# Altium schematic sheet BLOCK DIAGRAM.SchDoc
size A2; Organization: Altium Limited; Address1: L3, 12a Rodborough Rd; Address2: Frenchs Forest; Address3: NSW; Address4: Australia 2086
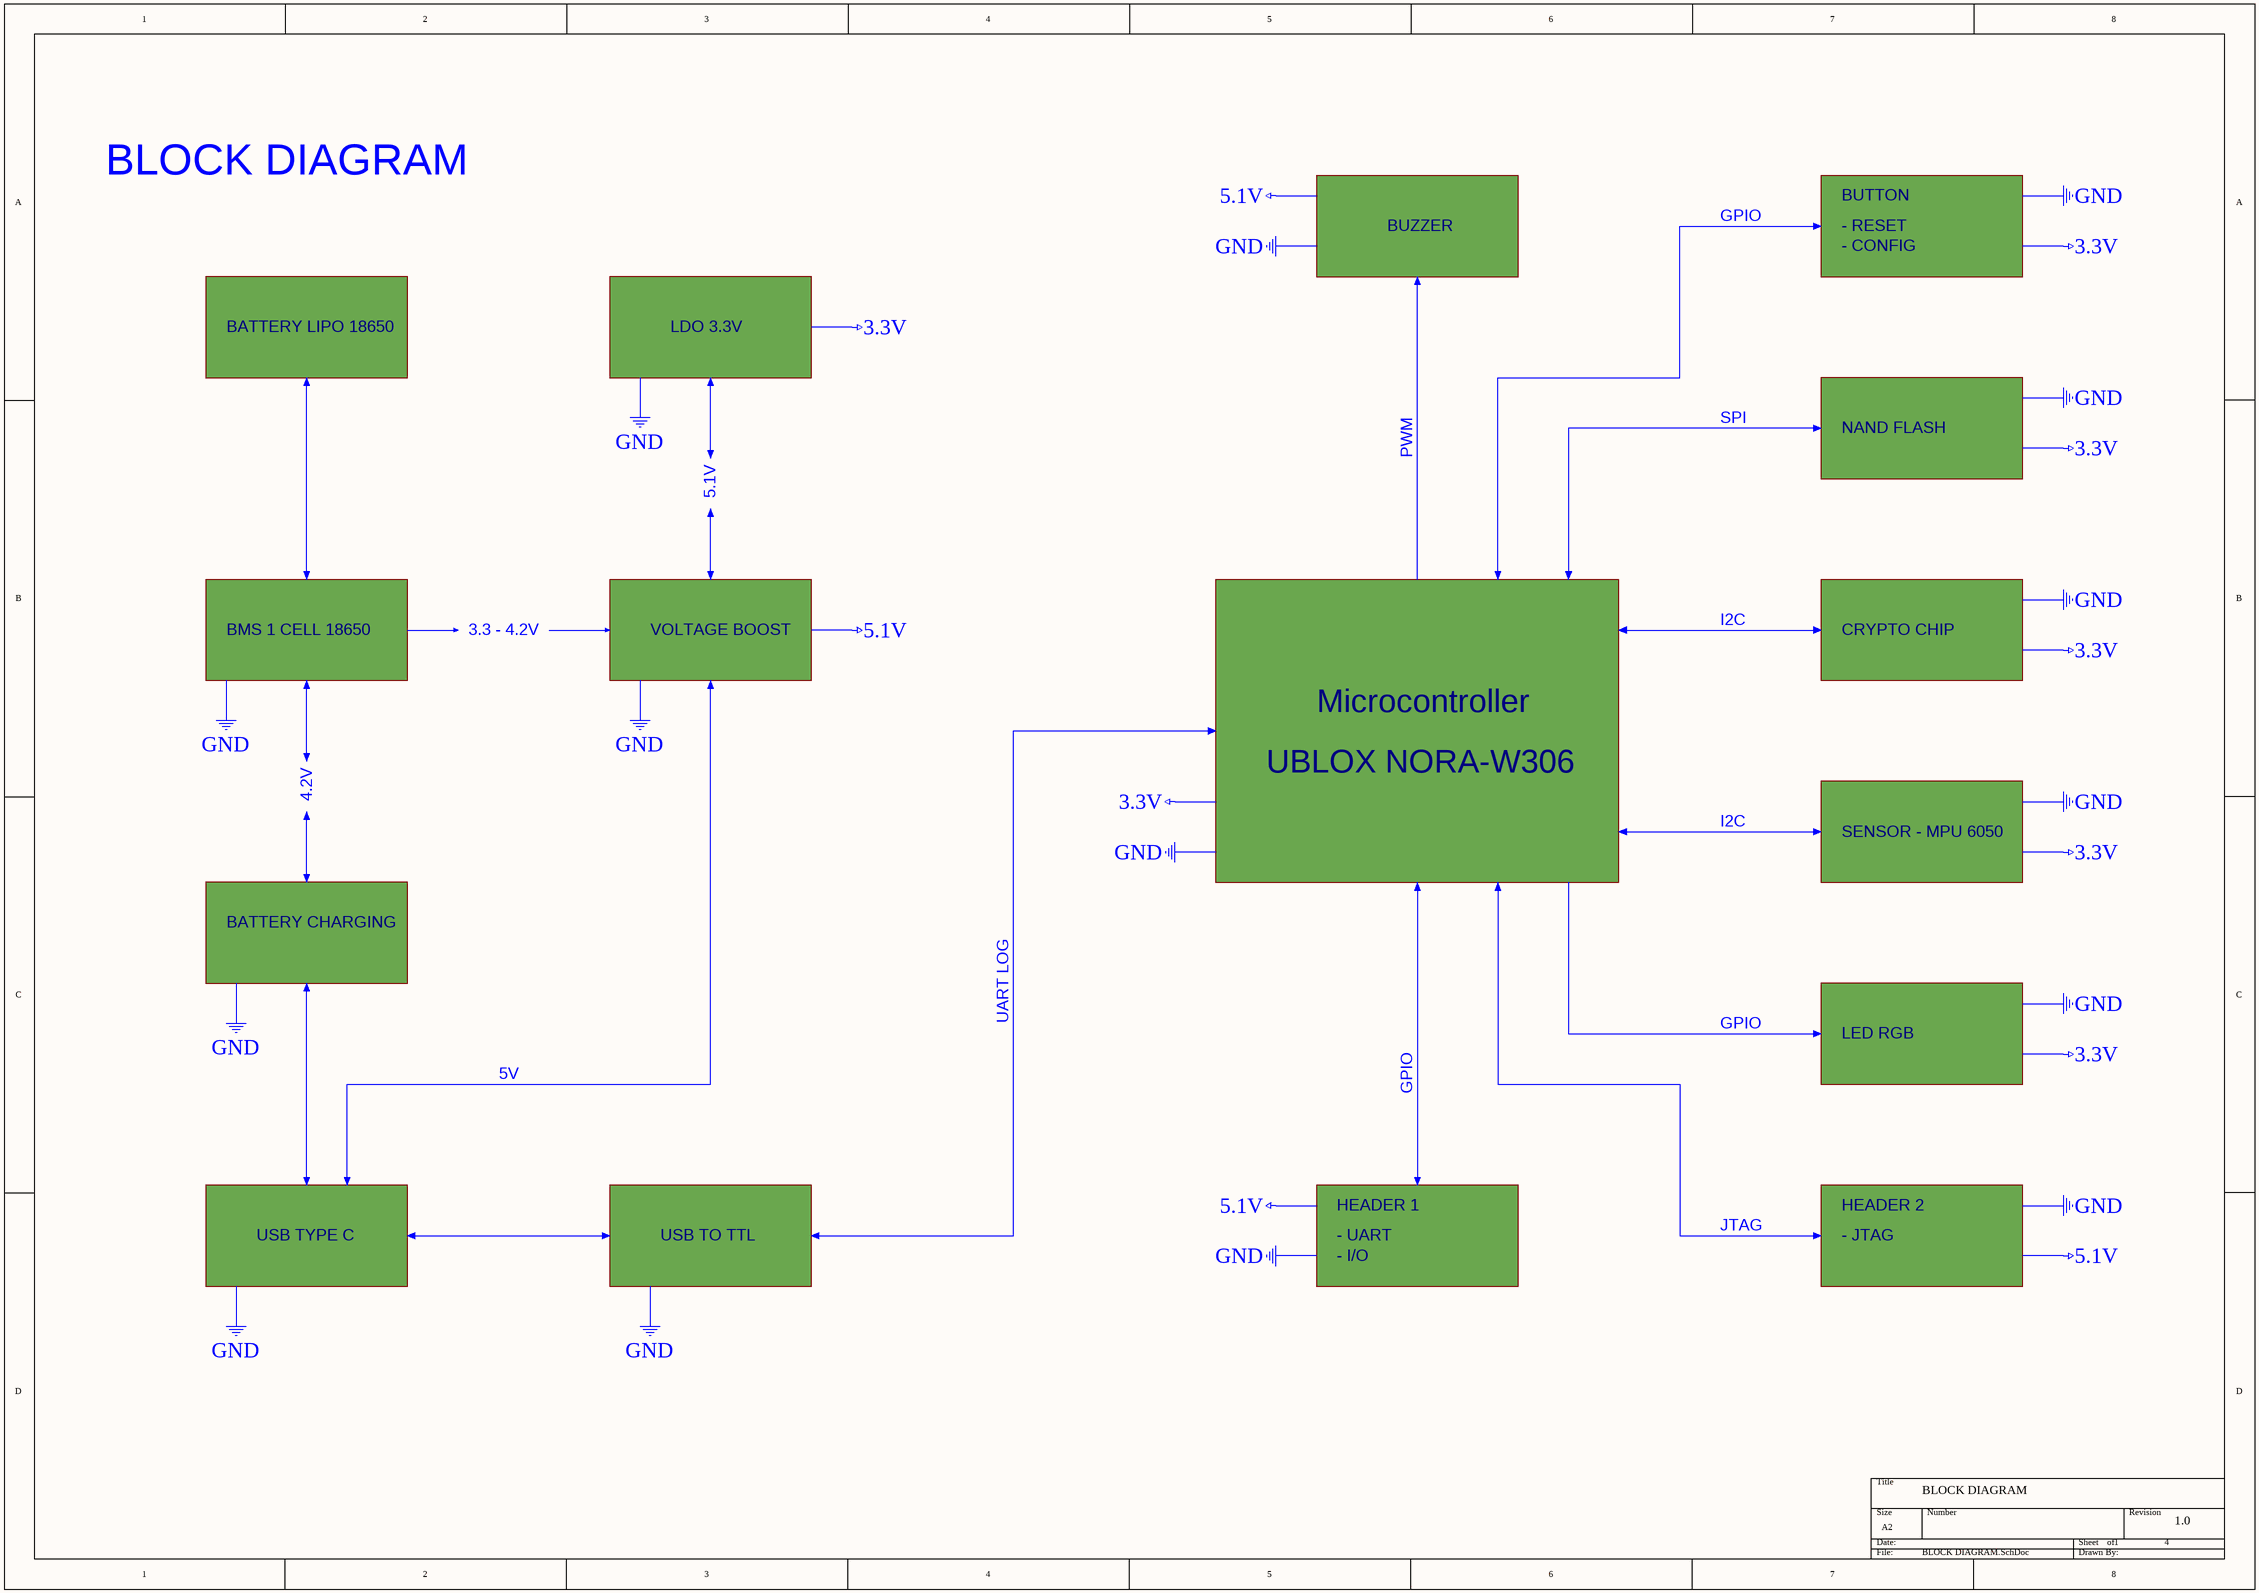
[diagram p0: BLOCK DIAGRAM.SchDoc]

## Notes on the sheet
- BLOCK DIAGRAM
- BUZZER
- GPIO
- BUTTON
- - RESET
- - CONFIG
- BATTERY LIPO 18650
- LDO 3.3V
- SPI
- NAND FLASH
- 5.1V
- PWM
- BMS 1 CELL 18650
- 3.3 - 4.2V
- VOLTAGE BOOST
- I2C
- CRYPTO CHIP
- Microcontroller
- 4.2V
- UBLOX NORA-W306
- SENSOR - MPU 6050
- BATTERY CHARGING
- UART LOG
- LED RGB
- 5V
- USB TYPE C
- USB TO TTL
- HEADER 1
- - UART
- JTAG
- HEADER 2
- - JTAG
- - I/O
- 1
- 4
- 1.0
- Labels drawn without touching a wire or pin: 3.3V, 5.1V, GND
- Title
- Size:
- Date:
- File:
- A2
- Number:
- Time:
- Revision:
- Sheet
- of